# Altium schematic sheet battery_interface.SchDoc: LV Battery Interface
size A4; Organization: Badgerloop; Address1: 133 Engineering Research; Address2: Building; Address3: Madison, WI 53715; SheetNumber: 15
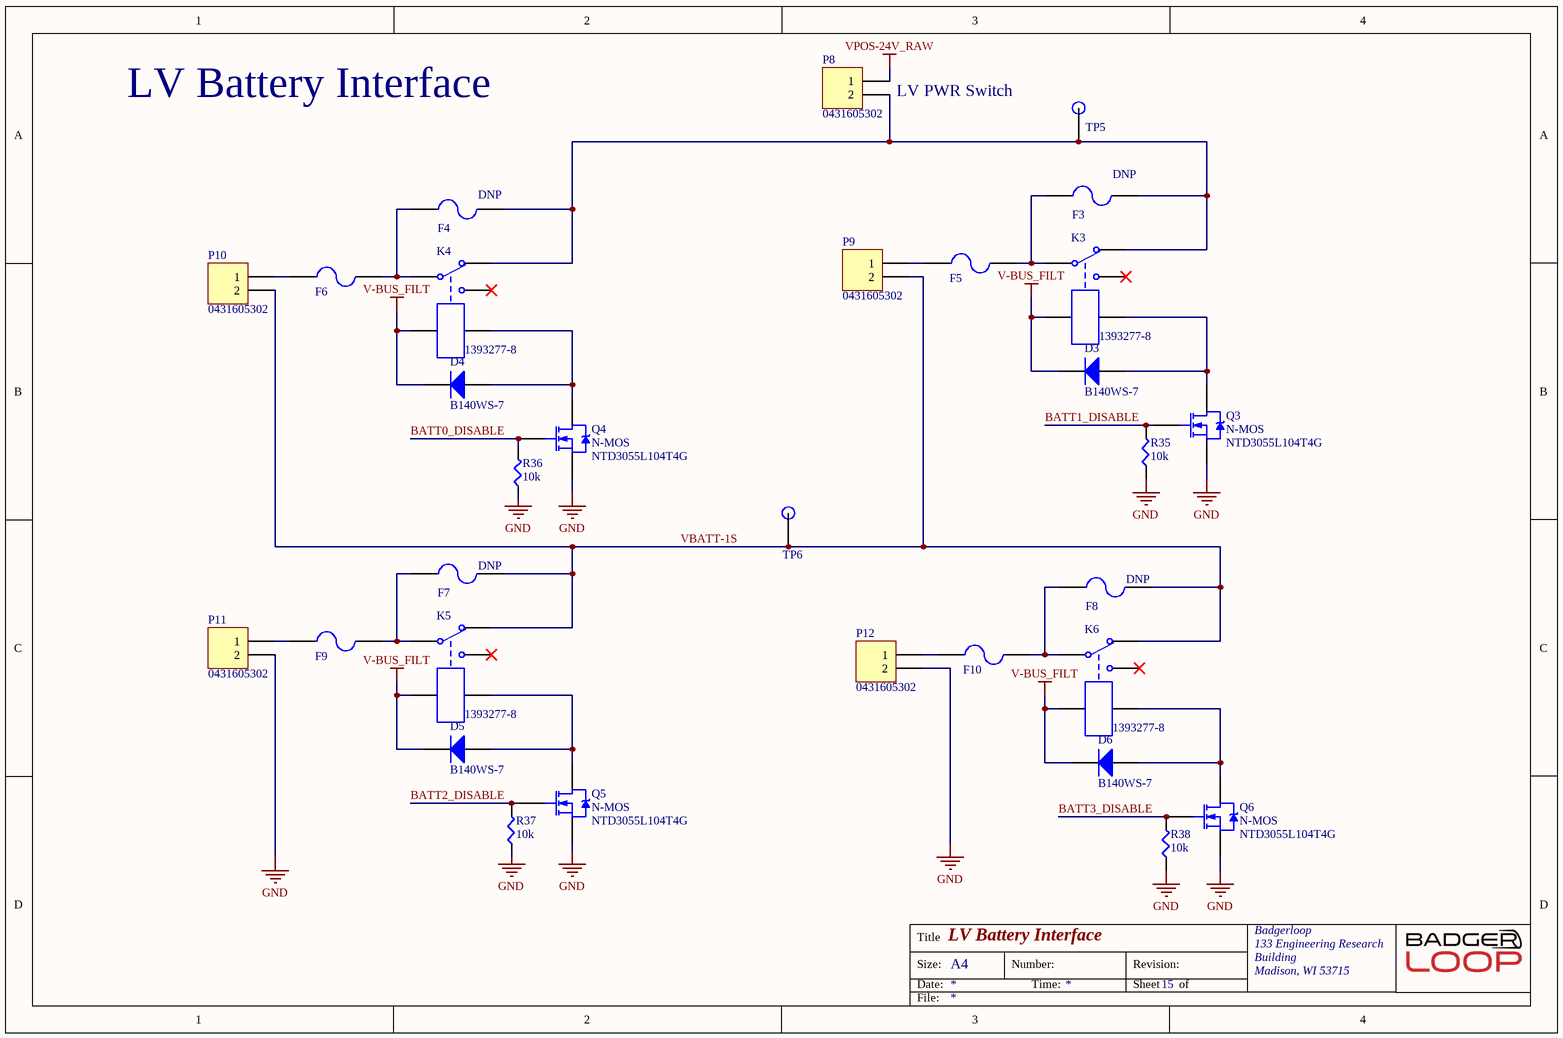
[diagram p0: battery_interface.SchDoc]

## Parts
D3  B140WS-7  [SODFL250X110-2N]
D4  B140WS-7  [SODFL250X110-2N]
D5  B140WS-7  [SODFL250X110-2N]
D6  B140WS-7  [SODFL250X110-2N]
F3  3568  [Fuse Holder 30A 500V 1 Circuit Blade Through Hole]  (value not drawn)
F4  3568  [Fuse Holder 30A 500V 1 Circuit Blade Through Hole]  (value not drawn)
F5  3568  [Fuse Holder 30A 500V 1 Circuit Blade Through Hole]  (value not drawn)
F6  3568  [Fuse Holder 30A 500V 1 Circuit Blade Through Hole]  (value not drawn)
F7  3568  [Fuse Holder 30A 500V 1 Circuit Blade Through Hole]  (value not drawn)
F8  3568  [Fuse Holder 30A 500V 1 Circuit Blade Through Hole]  (value not drawn)
F9  3568  [Fuse Holder 30A 500V 1 Circuit Blade Through Hole]  (value not drawn)
F10  3568  [Fuse Holder 30A 500V 1 Circuit Blade Through Hole]  (value not drawn)
K3  1393277-8  [RELAY AUTOMOTIVE SPDT 45A 24V - duplicate]
K4  1393277-8  [RELAY AUTOMOTIVE SPDT 45A 24V - duplicate]
K5  1393277-8  [RELAY AUTOMOTIVE SPDT 45A 24V - duplicate]
K6  1393277-8  [RELAY AUTOMOTIVE SPDT 45A 24V - duplicate]
P8  0431605302  [CONN HDR 2POS 7.50MM]
P9  0431605302  [CONN HDR 2POS 7.50MM]
P10  0431605302  [CONN HDR 2POS 7.50MM]
P11  0431605302  [CONN HDR 2POS 7.50MM]
P12  0431605302  [CONN HDR 2POS 7.50MM]
Q3  N-MOS  Manufacturer P/N: NTD3055L104T4G  [DPAK228P991X238-3N]
Q4  N-MOS  Manufacturer P/N: NTD3055L104T4G  [DPAK228P991X238-3N]
Q5  N-MOS  Manufacturer P/N: NTD3055L104T4G  [DPAK228P991X238-3N]
Q6  N-MOS  Manufacturer P/N: NTD3055L104T4G  [DPAK228P991X238-3N]
R35  10k  [SMD-0805-RES]
R36  10k  [SMD-0805-RES]
R37  10k  [SMD-0805-RES]
R38  10k  [SMD-0805-RES]
TP5  TP  [Test Point]  (value not drawn)
TP6  TP  [Test Point]  (value not drawn)

## Nets
GND: P11.2 P12.2 Q3.3(S) Q4.3(S) Q5.3(S) Q6.3(S) R35.1 R36.1 R37.1 R38.1
V-BUS_FILT: D3.2(K) D4.2(K) D5.2(K) D6.2(K) K3.1 K4.1 K5.1 K6.1
VPOS-24V_RAW: P8.1
BATT0_DISABLE: Q4.1(G) R36.2
BATT1_DISABLE: Q3.1(G) R35.2
BATT2_DISABLE: Q5.1(G) R37.2
BATT3_DISABLE: Q6.1(G) R38.2
VBATT-1S: F7.2 F8.2 K5.3 K6.3 P9.2 P10.2 TP6.1
NetD3_1: D3.1(A) K3.2 Q3.4(D)
NetD4_1: D4.1(A) K4.2 Q4.4(D)
NetD5_1: D5.1(A) K5.2 Q5.4(D)
NetD6_1: D6.1(A) K6.2 Q6.4(D)
NetF3_1: F3.1 F5.2 K3.4
NetF3_2: F3.2 F4.2 K3.3 K4.3 P8.2 TP5.1
NetF4_1: F4.1 F6.2 K4.4
NetF5_1: F5.1 P9.1
NetF6_1: F6.1 P10.1
NetF7_1: F7.1 F9.2 K5.4
NetF8_1: F8.1 F10.2 K6.4
NetF9_1: F9.1 P11.1
NetF10_1: F10.1 P12.1

Not connected (* = marked no-connect by the designer): K3 5*; K4 5*; K5 5*; K6 5*

## Notes on the sheet
- LV Battery Interface
- (near P8) LV PWR Switch
- Title
- Size:
- Date:
- A4
- Number:
- Time:
- Revision:
- Sheet
- of
- File:

## Library data of the parts
D3-D6 = B140WS-7: Diode Schottky 40V 1A 2-Pin SOD-323 T/R; Manufacturer: Diodes; Max Reverse Current: 50uA; Peak Non-Repetitive Surge Current: 3A; Element Configuration: Single; Forward Voltage: 620mV; Natural Thermal Resistance: 426°C/W; Supplier 1: Digi-Key; Stock 1: 38792; Pricing 1: 1=0.41, 10=0.293, 100=0.1476, 500=0.13076, 1000=0.10176 (USD); Mount: Surface Mount; Number of Pins: 2; Weight: 0.000173oz; Contact Plating: Tin,Matte; Min Operating Temperature: -40°C; Max Operating Temperature: 125°C; Forward Current: 1A; Max Repetitive Reverse Voltage (Vrrm): 40V; Package Quantity: 3000; Packaging: Tape and Reel; Average Rectified Current: 1A; Max Forward Surge Current (Ifsm): 3A; Max Reverse Voltage (DC): 40V; Series: -; Length: 1.8mm; Width: 1.4mm; Height: 1.1mm; RoHS Compliant: Yes; ComponentLink1URL: http://www.mouser.com/ds/2/115/ds31543-56649.pdf?src-supplier=Mouser; ComponentLink1Description: http://www.mouser.com/ds/2/115/ds31543-56649.pdf?src-supplier=Mouser; ComponentLink2URL: http://www.diodes.com//datasheets/ds31543.pdf?src-supplier=Avnet+Europe; ComponentLink2Description: http://www.diodes.com//datasheets/ds31543.pdf?src-supplier=Avnet+Europe; ComponentLink3URL: http://www.diodes.com/datasheets/ds31543.pdf?src-supplier=Digi-Key; ComponentLink3Description: http://www.diodes.com/datasheets/ds31543.pdf?src-supplier=Digi-Key; Supplier Part Number 1: B140WS-7DICT-ND
F3-F10 = 3568: FUSE HOLDER MINI AUTO PC; Manufacturer: Keystone Electronics; Material: Brass,Tin,Nylon; Color: Black; Body Material: Nylon; Current Rating: 20A; Voltage Rating (AC): 500V; Number of Poles: 1; Illumination Type: Illuminated; Fuse Type: Automotive; Approvals: UL; Supplier 1: Digi-Key; Manufacturer Part Number: 3568; Stock 1: 0; Mount: PCB,Vertical; Contact Material: Brass,Tin; Contact Plating: Tin; Min Operating Temperature: -50°C; Max Operating Temperature: 145°C; Package Quantity: 1; Termination: PC Pin; Orientation: Vertical; Number of Circuits: 1; Voltage: 500V; Fuse Current: 20A; Length: 16mm; Depth: 6.73mm; Lead Free: Lead Free; REACH SVHC: No SVHC; Flammability Rating: UL94 V-0; ComponentLink1URL: http://www.keyelco.com/userAssets/file/M60-2p40.pdf?src-supplier=Future+Electronics; ComponentLink1Description: http://www.keyelco.com/userAssets/file/M60-2p40.pdf?src-supplier=Future+Electronics; ComponentLink2URL: https://www.alliedelec.com/m/d/15b4f09b8ba48c4b08efedd730709c21.pdf?src-supplier=Allied+Electronics; ComponentLink2Description: https://www.alliedelec.com/m/d/15b4f09b8ba48c4b08efedd730709c21.pdf?src-supplier=Allied+Electronics; Supplier Part Number 1: 3568K-ND
  F3 F4 F7 F8: DNP: DNP
K3-K6 = 1393277-8: RELAY AUTOMOTIVE SPDT 45A 24V; Manufacturer: TE Connectivity; Coil Current: 66.29mA; Coil Resistance: 362R; Coil Power: 1.6W; Operate Time: 5ms; Number of Contacts: 2; Release Time: 3ms; Coil Type: Non-Latching; Supplier 1: Digi-Key; Manufacturer Part Number: 1393277-8; Stock 1: 2937; Pricing 1: 1=5.39, 10=5.053, 25=4.4912, 50=4.2666, 100=4.042, 250=3.73328 (USD); Mount: Through Hole; Number of Pins: 7; Weight: 22g; Contact Material: Silver; Min Operating Temperature: -40°C; Max Operating Temperature: 105°C; Throw Configuration: SPDT; Coil Voltage (DC): 24V; Termination: PCB; Contact Current Rating: 45A; Current Rating: 45A; Packaging: Bulk; Package Quantity: 525; Relay Type: Relay; Length: 26.1mm; Height: 21.2mm; Depth: 21.1mm; Width: 21.1mm; Radiation Hardening: No; Lead Free: Lead Free; ELV: Compliant; ComponentLink1URL: https://www.verical.com/server-webapp/html/getDatasheet?partID=318318&src-supplier=Verical; ComponentLink1Description: https://www.verical.com/server-webapp/html/getDatasheet?partID=318318&src-supplier=Verical; ComponentLink2URL: https://www.te.com/commerce/DocumentDelivery/DDEController?Action=srchrtrv&DocNm=V23133-X0000-A001&DocType=DS&DocLang=English&src-supplier=Digi-Key; ComponentLink2Description: https://www.te.com/commerce/DocumentDelivery/DDEController?Action=srchrtrv&DocNm=V23133-X0000-A001&DocType=DS&DocLang=English&src-supplier=Digi-Key; Supplier Part Number 1: PB1320-ND
P8-P12 = 0431605302: Conn Power HDR 2 POS 7.49mm Solder RA Thru-Hole 4 Terminal 1 Port Sabre™ Tray; Manufacturer: Molex; Current Rating: 18A; Number of Positions: 2; Voltage Rating: 600V; Number of Ports: 1; Contact Resistance: 30mR; Supplier 1: Digi-Key; Manufacturer Part Number: 0431605302; Stock 1: 0; Mount: Through Hole; Housing Material: Nylon; Contact Material: Brass; Contact Plating: Tin,Copper; Color: Black; Insulation Material: Nylon; Number of Terminals: 4; Housing Color: Black; Min Operating Temperature: -40°C; Max Operating Temperature: 75°C; Number of Rows: 1; Packaging: Tray; Package Quantity: 525; Termination: Solder; Number of Contacts: 2; Orientation: Right Angle; Fastening Type: Ramp; Length: 21.08mm; Pitch: 7.49mm; Depth: 19.79mm; ComponentLink1URL: https://www.verical.com/server-webapp/html/getDatasheet?partID=198412&src-supplier=Verical; ComponentLink1Description: https://www.verical.com/server-webapp/html/getDatasheet?partID=198412&src-supplier=Verical; ComponentLink2URL: http://components.arrow.com/part/dataview/2942820S6220968N3303?src-supplier=Arrow; ComponentLink2Description: http://components.arrow.com/part/dataview/2942820S6220968N3303?src-supplier=Arrow; ComponentLink3URL: http://www.molex.com/pdm_docs/ps/PSX-43335-9999.pdf?src-supplier=Digi-Key; ComponentLink3Description: http://www.molex.com/pdm_docs/ps/PSX-43335-9999.pdf?src-supplier=Digi-Key; Supplier Part Number 1: WM13983-ND
Q3-Q6 = N-MOS: N-Channel Power MOSFET, 12 A, 60 V; Manufacturer: ON SEMI; Digikey Link: https://www.digikey.com/product-detail/en/on-semiconductor/NTD3055L104T4G/NTD3055L104T4GOSDKR-ND/1749196; Digikey P/N: NTD3055L104T4GOSDKR-ND
R35-R38 = ERJ-P06J103V: RES SMD 10K OHM 5% 1/2W 0805; Manufacturer: Panasonic Electronic Components; Factory Stock: 0; Unit Price (USD): 0.01839; @ qty: 1500; Minimum Quantity: 1; Power (Watts): 0.5W, 1/2W; Temperature Coefficient: ±200ppm/°C; Part Number: ERJ-P06J103V; Datasheets: https://industrial.panasonic.com/cdbs/www-data/pdf/RDA0000/AOA0000C243.pdf; Image: //media.digikey.com/Renders/Panasonic%20Renders/ERJ-0805%20Pkg.jpg; Digi-Key Part Number: P10KADCT-ND; Quantity Available: 413576; Packaging: Cut Tape (CT); Series: ERJ; Part Status: Active; Value: 10k; Tolerance: ±5%; Composition: Thick Film; Features: Automotive AEC-Q200, Pulse Withstanding; Operating Temperature: -55°C ~ 155°C; Package / Case: 0805 (2012 Metric); Supplier Device Package: 0805; Size / Dimension: 0.079" L x 0.049" W (2.00mm x 1.25mm); Height - Seated (Max): 0.028" (0.70mm); Number of Terminations: 2; Failure Rate: -
TP5 TP6 = TP: SMD TEST POINT